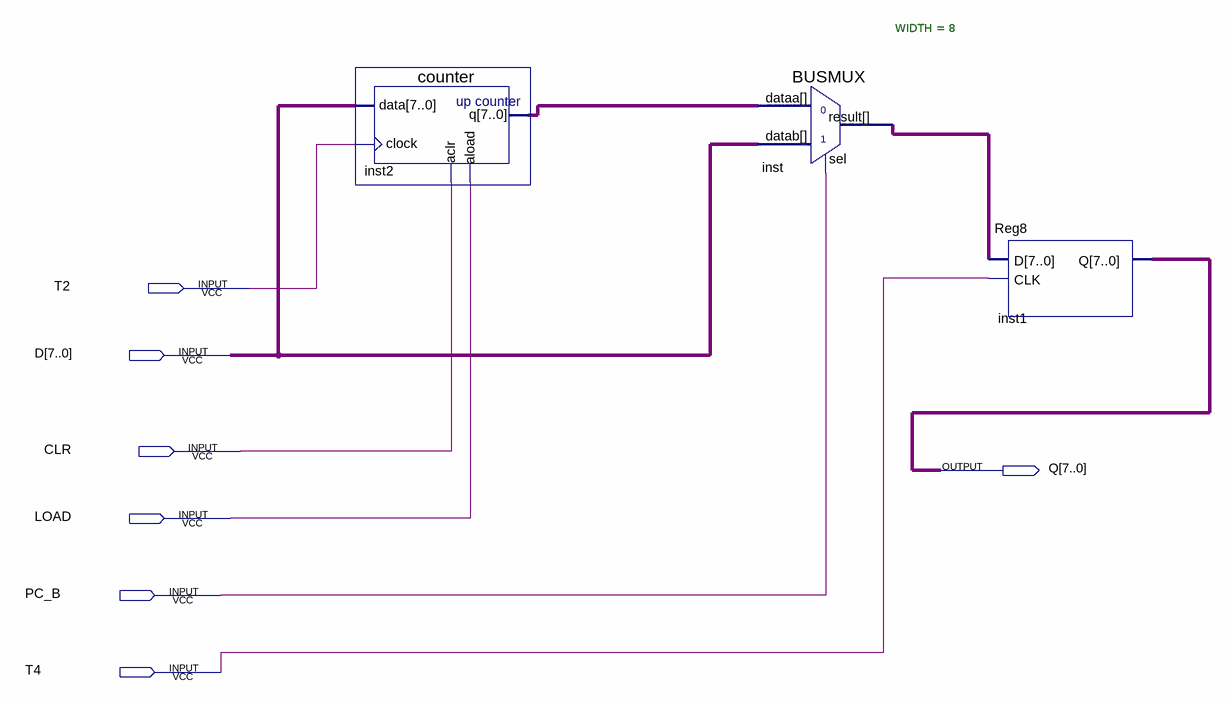
[diagram p0: schematic sheet]
// Quartus schematic Block1.bdf as structural Verilog: 3 symbols, 7 pins
module Block1 (
  input  T2,
  input  [7:0] D,
  input  CLR,
  input  LOAD,
  input  PC_B,
  input  T4,
  output [7:0] Q
);

  wire [7:0] inst2_q, inst_result;

  counter inst2 (.data(D), .clock(T2), .aclr(CLR), .aload(LOAD), .q(inst2_q));
  BUSMUX #(.WIDTH(8)) inst (.datab(D), .sel(PC_B), .dataa(inst2_q), .result(inst_result));
  Reg8 inst1 (.D(inst_result), .CLK(T4), .Q(Q));
endmodule
